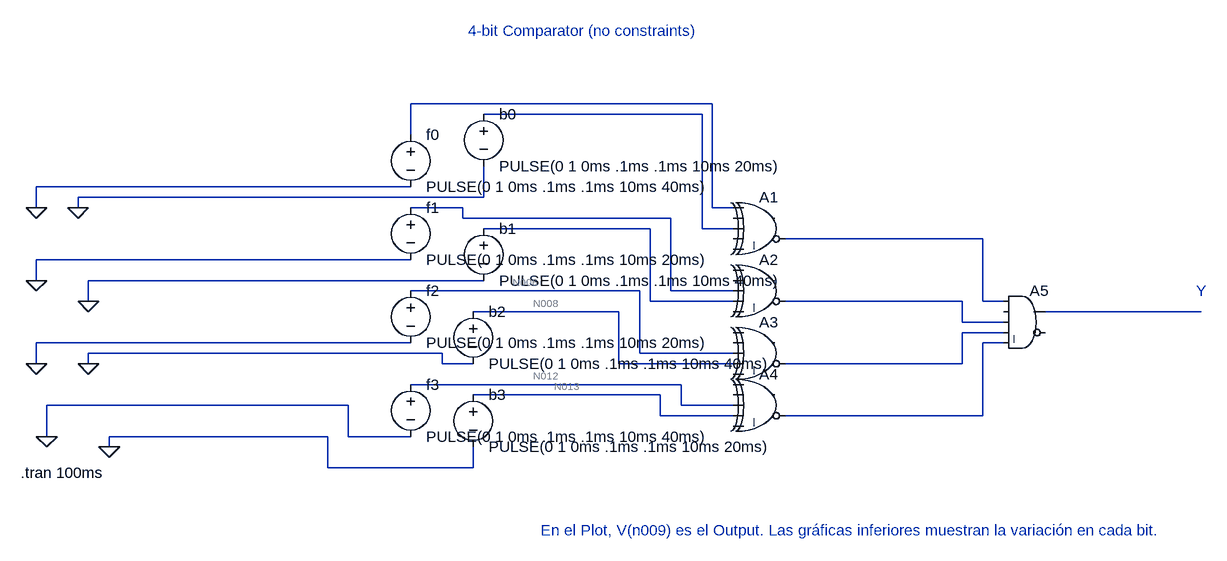
[diagram p0: schematic Lab_01.asc]
Lab_01.asc, the LTspice schematic file:
Version 4
SHEET 1 880 680
WIRE -96 -128 -560 -128
WIRE -112 -112 -448 -112
WIRE -560 -80 -560 -128
WIRE -560 0 -1136 0
WIRE -448 16 -448 -32
WIRE -448 16 -1072 16
WIRE -1136 32 -1136 0
WIRE -1072 32 -1072 16
WIRE -480 32 -560 32
WIRE -96 32 -96 -128
WIRE -64 32 -96 32
WIRE -480 48 -480 32
WIRE -160 48 -480 48
WIRE -192 64 -448 64
WIRE -112 64 -112 -112
WIRE -64 64 -112 64
WIRE 320 80 16 80
WIRE -560 112 -1136 112
WIRE -1136 144 -1136 112
WIRE -448 144 -1056 144
WIRE -208 160 -560 160
WIRE -160 160 -160 48
WIRE -64 160 -160 160
WIRE -1056 176 -1056 144
WIRE -192 176 -192 64
WIRE -64 176 -192 176
WIRE 288 176 16 176
WIRE 320 176 320 80
WIRE 352 176 320 176
WIRE -240 192 -464 192
WIRE 656 192 416 192
WIRE 288 208 288 176
WIRE 352 208 288 208
WIRE 352 224 288 224
WIRE -560 240 -1136 240
WIRE 352 240 320 240
WIRE -512 256 -1056 256
WIRE -208 256 -208 160
WIRE -64 256 -208 256
WIRE -1136 272 -1136 240
WIRE -1056 272 -1056 256
WIRE -512 272 -512 256
WIRE -464 272 -512 272
WIRE -240 272 -240 192
WIRE -64 272 -240 272
WIRE 288 272 288 224
WIRE 288 272 16 272
WIRE -144 304 -560 304
WIRE -176 320 -464 320
WIRE -656 336 -1120 336
WIRE -144 336 -144 304
WIRE -64 336 -144 336
WIRE -176 352 -176 320
WIRE -64 352 -176 352
WIRE 320 352 320 240
WIRE 320 352 16 352
WIRE -1120 384 -1120 336
WIRE -688 384 -1024 384
WIRE -656 384 -656 336
WIRE -560 384 -656 384
WIRE -1024 400 -1024 384
WIRE -688 432 -688 384
WIRE -464 432 -464 400
WIRE -464 432 -688 432
FLAG -1136 32 0
FLAG -1072 32 0
FLAG -1056 176 0
FLAG -1136 272 0
FLAG -1056 272 0
FLAG -1120 384 0
FLAG -1024 400 0
FLAG -1136 144 0
SYMBOL Digital\\xor -16 0 R0
SYMATTR InstName A1
SYMBOL Digital\\xor -16 96 R0
SYMATTR InstName A2
SYMBOL Digital\\xor -16 192 R0
SYMATTR InstName A3
SYMBOL Digital\\xor -16 272 R0
SYMATTR InstName A4
SYMBOL Digital\\and 384 144 R0
SYMATTR InstName A5
SYMBOL voltage -560 -96 R0
WINDOW 123 0 0 Left 0
WINDOW 39 0 0 Left 0
SYMATTR InstName f0
SYMATTR Value PULSE(0 1 0ms .1ms .1ms 10ms 40ms)
SYMBOL voltage -448 -128 R0
WINDOW 123 0 0 Left 0
WINDOW 39 0 0 Left 0
SYMATTR InstName b0
SYMATTR Value PULSE(0 1 0ms .1ms .1ms 10ms 20ms)
SYMBOL voltage -560 16 R0
WINDOW 123 0 0 Left 0
WINDOW 39 0 0 Left 0
SYMATTR InstName f1
SYMATTR Value PULSE(0 1 0ms .1ms .1ms 10ms 20ms)
SYMBOL voltage -448 48 R0
WINDOW 123 0 0 Left 0
WINDOW 39 0 0 Left 0
SYMATTR InstName b1
SYMATTR Value PULSE(0 1 0ms .1ms .1ms 10ms 40ms)
SYMBOL voltage -560 144 R0
WINDOW 123 0 0 Left 0
WINDOW 39 0 0 Left 0
SYMATTR InstName f2
SYMATTR Value PULSE(0 1 0ms .1ms .1ms 10ms 20ms)
SYMBOL voltage -464 176 R0
WINDOW 123 0 0 Left 0
WINDOW 39 0 0 Left 0
SYMATTR InstName b2
SYMATTR Value PULSE(0 1 0ms .1ms .1ms 10ms 40ms)
SYMBOL voltage -560 288 R0
WINDOW 123 0 0 Left 0
WINDOW 39 0 0 Left 0
SYMATTR InstName f3
SYMATTR Value PULSE(0 1 0ms .1ms .1ms 10ms 40ms)
SYMBOL voltage -464 304 R0
WINDOW 123 0 0 Left 0
WINDOW 39 0 0 Left 0
SYMATTR InstName b3
SYMATTR Value PULSE(0 1 0ms .1ms .1ms 10ms 20ms)
TEXT -1160 440 Left 2 !.tran 100ms
TEXT -472 -240 Left 2 ;4-bit Comparator (no constraints)
TEXT -360 528 Left 2 ;En el Plot, V(n009) es el Output. Las gráficas inferiores muestran la variación en cada bit.
TEXT 648 160 Left 2 ;Y

The netlist it stands for:
* Lab_01.asc
A1 N001 0 N002 0 0 N005 0 0 XOR
A2 0 0 N003 N004 0 N007 0 0 XOR
A3 0 0 N006 N008 0 N010 0 0 XOR
A4 0 0 N012 N013 0 N011 0 0 XOR
A5 N005 0 N007 N010 N011 0 N009 0 AND
V§f0 N001 0 PULSE(0 1 0ms .1ms .1ms 10ms 40ms)
V§b0 N002 0 PULSE(0 1 0ms .1ms .1ms 10ms 20ms)
V§f1 N003 0 PULSE(0 1 0ms .1ms .1ms 10ms 20ms)
V§b1 N004 0 PULSE(0 1 0ms .1ms .1ms 10ms 40ms)
V§f2 N006 0 PULSE(0 1 0ms .1ms .1ms 10ms 20ms)
V§b2 N008 0 PULSE(0 1 0ms .1ms .1ms 10ms 40ms)
V§f3 N012 0 PULSE(0 1 0ms .1ms .1ms 10ms 40ms)
V§b3 N013 0 PULSE(0 1 0ms .1ms .1ms 10ms 20ms)
.tran 100ms
* 4-bit Comparator (no constraints)
* En el Plot, V(n009) es el Output. Las gráficas inferiores muestran la variación en cada bit.
* Y
.backanno
.end

* Results of the author's LTspice run, read from the files saved beside the schematic
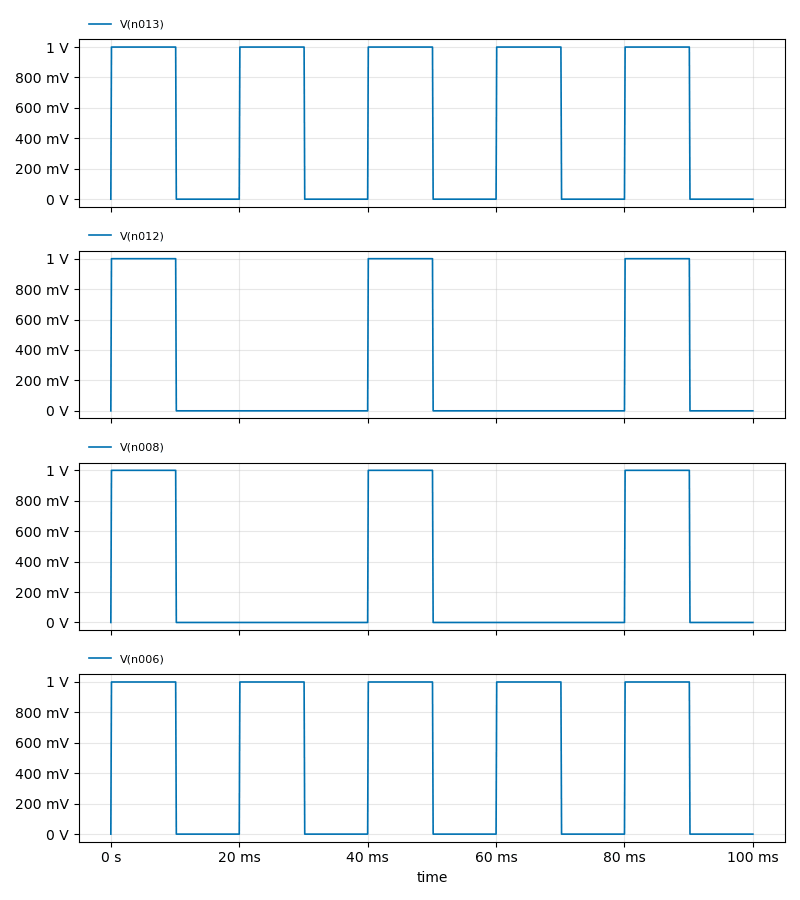
[diagram p1: Transient Analysis of Lab_01.asc, plotted from the saved traces]
* Transient Analysis, 1 run:
*   V(n013): min 0 V, max 1 V, average 505 mV, rms 710.2 mV, last 0 V
*   V(n012): min 0 V, max 1 V, average 303 mV, rms 550.5 mV, last 0 V
*   V(n008): min 0 V, max 1 V, average 303 mV, rms 550.5 mV, last 0 V
*   V(n006): min 0 V, max 1 V, average 505 mV, rms 710.2 mV, last 0 V